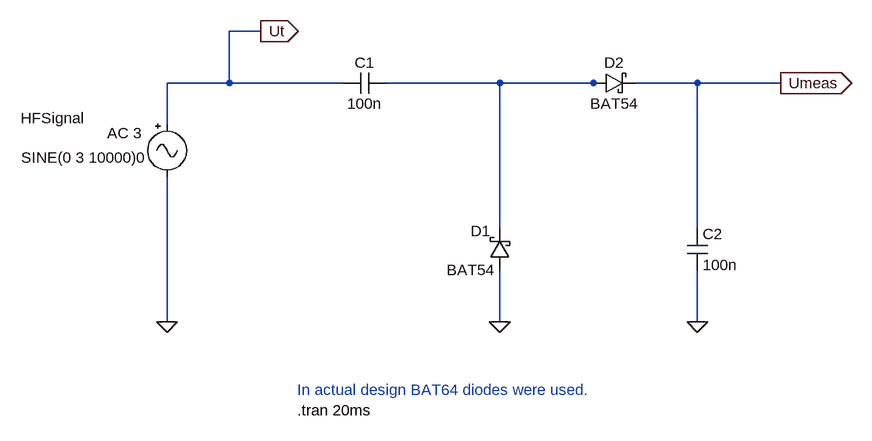
[diagram p0: schematic HF_Probe_FullWaveRectifier.asc]
HF_Probe_FullWaveRectifier.asc, the LTspice schematic file:
Version 4
SHEET 1 920 680
WIRE -928 -1504 -976 -1504
WIRE -976 -1424 -976 -1504
WIRE -976 -1424 -1072 -1424
WIRE -800 -1424 -976 -1424
WIRE -560 -1424 -736 -1424
WIRE -416 -1424 -560 -1424
WIRE -400 -1424 -416 -1424
WIRE -256 -1424 -352 -1424
WIRE -128 -1424 -256 -1424
WIRE -1072 -1360 -1072 -1424
WIRE -560 -1200 -560 -1424
WIRE -256 -1200 -256 -1424
WIRE -1072 -1056 -1072 -1280
WIRE -560 -1056 -560 -1136
WIRE -256 -1056 -256 -1136
FLAG -560 -1056 0
FLAG -1072 -1056 0
FLAG -256 -1056 0
FLAG -128 -1424 Umeas
IOPIN -128 -1424 Out
FLAG -928 -1504 Ut
IOPIN -928 -1504 Out
SYMBOL Misc\\signal -1072 -1376 R0
WINDOW 123 -92 29 Left 2
WINDOW 39 0 0 Left 0
WINDOW 0 -225 6 Left 2
WINDOW 3 -224 67 Left 2
SYMATTR Value2 AC 3
SYMATTR InstName HFSignal
SYMATTR Value SINE(0 3 10000)0
SYMBOL cap -272 -1200 R0
SYMATTR InstName C2
SYMATTR Value 100n
SYMBOL schottky -544 -1136 R180
WINDOW 0 30 60 Left 2
WINDOW 3 24 0 Left 2
SYMATTR InstName D1
SYMATTR Value BAT54
SYMATTR Description Diode
SYMATTR Type diode
SYMBOL schottky -416 -1408 R270
WINDOW 0 32 32 VTop 2
WINDOW 3 0 32 VBottom 2
SYMATTR InstName D2
SYMATTR Value BAT54
SYMATTR Description Diode
SYMATTR Type diode
SYMBOL cap -736 -1440 R90
WINDOW 0 0 32 VBottom 2
WINDOW 3 32 32 VTop 2
SYMATTR InstName C1
SYMATTR Value 100n
TEXT -872 -920 Left 2 !.tran 20ms
TEXT -872 -952 Left 2 ;In actual design BAT64 diodes were used.

The netlist it stands for:
* HF_Probe_FullWaveRectifier.asc
V§HFSignal Ut 0 SINE(0 3 10000)0 AC 3
C2 Umeas 0 100n
D1 0 N001 BAT54
D2 N001 Umeas BAT54
C1 N001 Ut 100n
.model D D
.lib standard.dio
.tran 20ms
* In actual design BAT64 diodes were used.
.backanno
.end